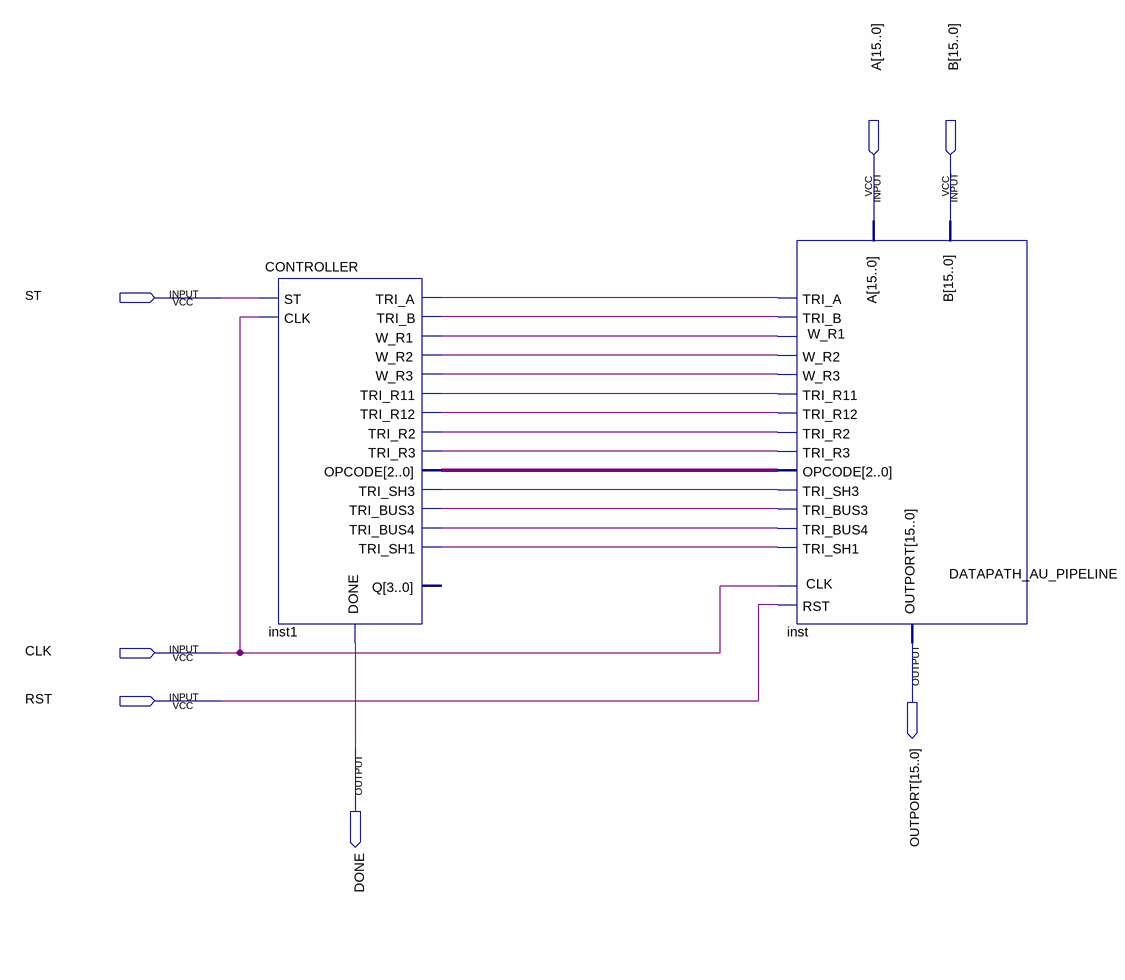
[diagram p0: schematic sheet]
// Quartus schematic PIPELINE_AU.bdf as structural Verilog: 2 symbols, 7 pins
module PIPELINE_AU (
  input  [15:0] A,
  input  [15:0] B,
  input  ST,
  input  CLK,
  input  RST,
  output [15:0] OUTPORT,
  output DONE
);

  wire inst1_tri_a, inst1_tri_b, inst1_tri_bus3, inst1_tri_bus4, inst1_tri_r2, inst1_tri_r3, inst1_tri_r11,
       inst1_tri_r12, inst1_tri_sh1, inst1_tri_sh3, inst1_w_r1, inst1_w_r2, inst1_w_r3;
  wire [2:0] inst1_opcode;

  CONTROLLER inst1 (
    .ST(ST), .CLK(CLK), .TRI_A(inst1_tri_a), .TRI_B(inst1_tri_b), .W_R1(inst1_w_r1), .W_R2(inst1_w_r2),
    .W_R3(inst1_w_r3), .TRI_R11(inst1_tri_r11), .TRI_R12(inst1_tri_r12), .TRI_R2(inst1_tri_r2),
    .TRI_R3(inst1_tri_r3), .OPCODE(inst1_opcode), .TRI_SH3(inst1_tri_sh3), .TRI_BUS3(inst1_tri_bus3),
    .TRI_BUS4(inst1_tri_bus4), .TRI_SH1(inst1_tri_sh1), .DONE(DONE));  // open: Q
  DATAPATH_AU_PIPELINE inst (
    .CLK(CLK), .RST(RST), .A(A), .B(B), .W_R1(inst1_w_r1), .W_R2(inst1_w_r2), .W_R3(inst1_w_r3),
    .TRI_R11(inst1_tri_r11), .TRI_R12(inst1_tri_r12), .TRI_R2(inst1_tri_r2), .TRI_R3(inst1_tri_r3),
    .OPCODE(inst1_opcode), .TRI_SH3(inst1_tri_sh3), .TRI_A(inst1_tri_a), .TRI_BUS3(inst1_tri_bus3),
    .TRI_BUS4(inst1_tri_bus4), .TRI_B(inst1_tri_b), .TRI_SH1(inst1_tri_sh1), .OUTPORT(OUTPORT));
endmodule
